# Altium project FanController.PrjPCB
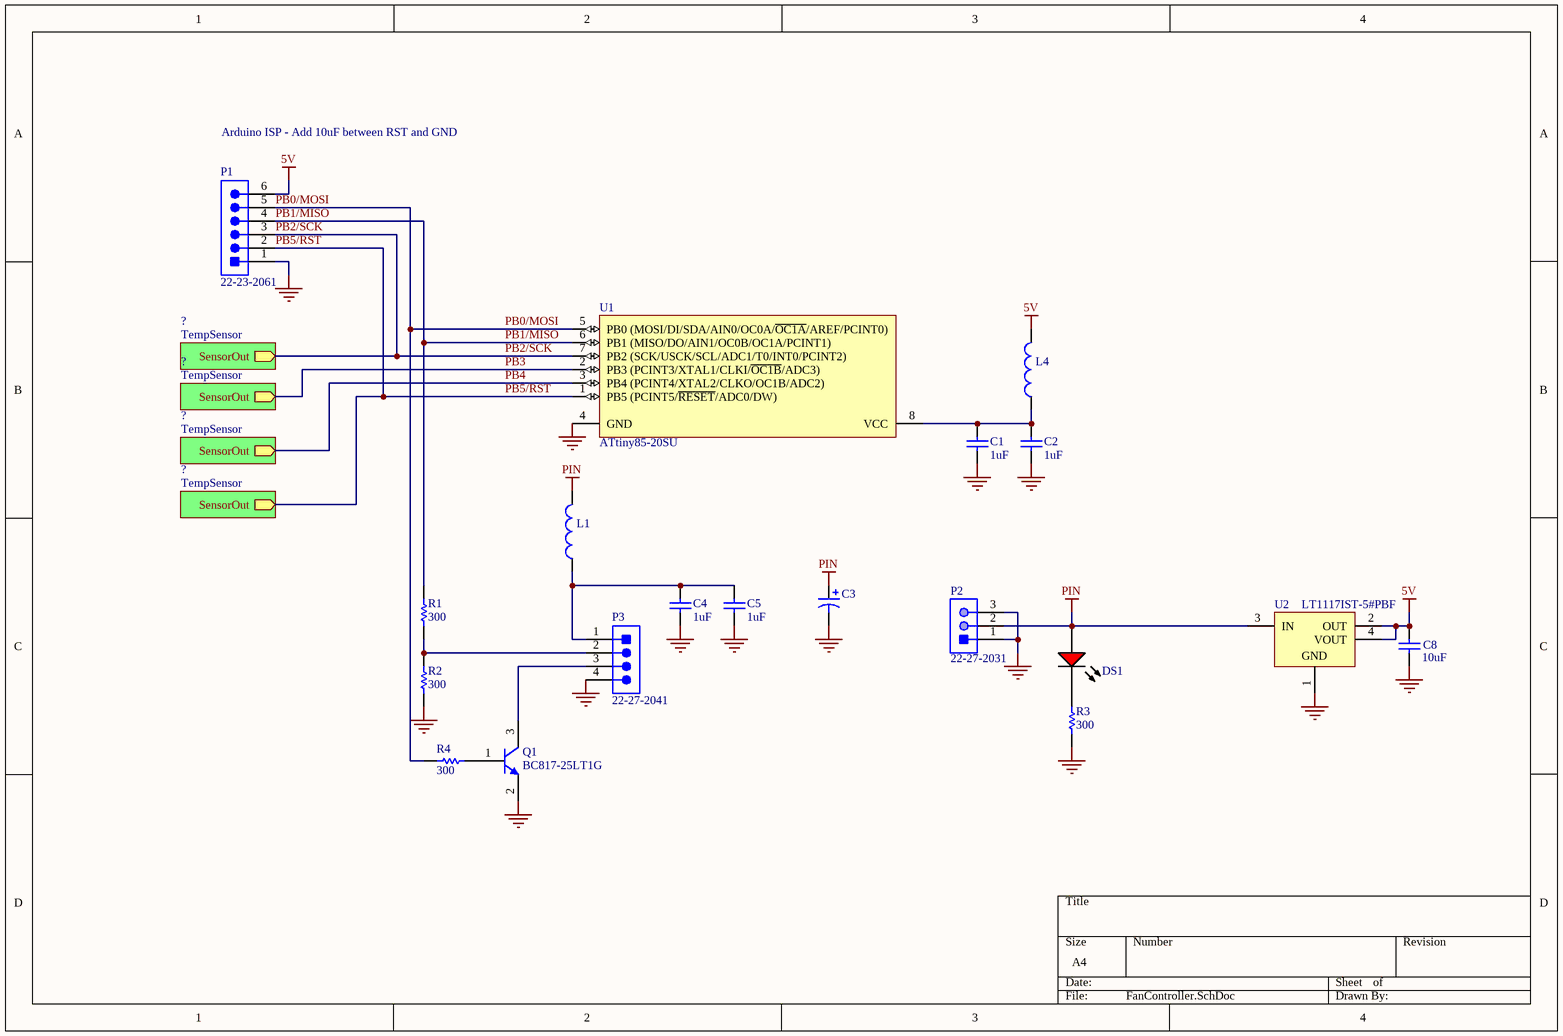
[diagram p0: FanController.SchDoc]
2 sheets, 43 parts. Net scope: hierarchical (ports join the sheet entries above them; power ports are global).
Board file: FanController.PcbDoc
Sheets:
  FanController.SchDoc
    ? = TempSensor.SchDoc
    ? = TempSensor.SchDoc
    ? = TempSensor.SchDoc
    ? = TempSensor.SchDoc

## Sheet FanController.SchDoc
size A4

### Parts
C1  1uF  [CAPC0805(2012)145_N]
C2  1uF  [CAPC0805(2012)145_N]
C3  ECA-1JHG471  [PNSC-ECA-1JHG471]  (value not drawn)
C4  1uF  [CAPC0805(2012)145_N]
C5  1uF  [CAPC0805(2012)145_N]
C8  10uF  [CAPC1206(3216)130_L]
DS1  TLMS1100-GS08  [VISH-TLMX1100_V]  (value not drawn)
L1  FBMJ2125HM210NT  [INDC2013X105X50LL20T30]  (value not drawn)
L4  FBMJ2125HM210NT  [INDC2013X105X50LL20T30]  (value not drawn)
P1  22-23-2061  [MOLX-22-23-2061_V]
P2  22-27-2031  [MOLX-22-27-2031_V]
P3  22-27-2041  [MOLX-22-27-2041_V]
Q1  BC817-25LT1G  [ONSC-SOT-23-3-318-08_V]
R1  300  [RESC0805(2012)_M]
R2  300  [RESC0805(2012)_M]
R3  300  [RESC0805(2012)_M]
R4  300  [RESC0805(2012)_M]
U1  ATtiny85-20SU  [8S2_M]
U2  LT1117IST-5#PBF  [LT-ST-3-SOT-223_L]

### Sub-sheets
? = TempSensor: SensorOut (out)
? = TempSensor: SensorOut (out)
? = TempSensor: SensorOut (out)
? = TempSensor: SensorOut (out)

### Nets
5V: C8.2 L4.2 P1.6 U2.2(OUT) U2.4(VOUT)
GND: C1.1 C2.1 C3.2(-) C4.1 C5.1 C8.1 P1.1 P2.1 P2.3 P3.4 Q1.2(E) R2.1 R3.1 U1.4(GND) U2.1(GND)
PIN: C3.1(+) DS1.1(A) L1.2 P2.2 U2.3(IN)
PB0/MOSI: P1.5 R4.1 U1.5(PB0_(MOSI/DI/SDA/AIN0/OC0A/~{OC1A}/AREF/PCINT0))
PB1/MISO: P1.4 R1.2 U1.6(PB1_(MISO/DO/AIN1/OC0B/OC1A/PCINT1))
PB2/SCK: P1.3 U1.7(PB2_(SCK/USCK/SCL/ADC1/T0/INT0/PCINT2)) ; sheet ?/SensorOut
PB3: U1.2(PB3_(PCINT3/XTAL1/CLKI/~{OC1B}/ADC3)) ; sheet ?/SensorOut
PB4: U1.3(PB4_(PCINT4/XTAL2/CLKO/OC1B/ADC2)) ; sheet ?/SensorOut
PB5/RST: P1.2 U1.1(PB5_(PCINT5/~{RESET}/ADC0/DW)) ; sheet ?/SensorOut
NetC1_2: C1.2 C2.2 L4.1 U1.8(VCC)
NetC4_2: C4.2 C5.2 L1.1 P3.1
NetDS1_2: DS1.2(K) R3.2
NetP3_2: P3.2 R1.1 R2.2
NetP3_3: P3.3 Q1.3(C)
NetQ1_1: Q1.1(B) R4.2

### Notes on the sheet
- Arduino ISP - Add 10uF between RST and GND

### Library data of the parts
C1 C2 C4 C5 = CMP-1036-04431-1: Case-Metric: 2012; Value: 100nF; Rated Voltage: 100 V; Tolerance: Â±20%; Case-EIA: 0805; Technology: SMT; Max Thickness: 1.45 mm
C3 = CMP-1665-00014-2: CAP ALUM 470UF 63V 20% RADIAL; Manufacturer: Panasonic; PartNumber: ECA-1JHG471; ComponentLink1Description: Datasheet; PackageReference: ECA-1JHG471; ComponentLink1URL: http://industrial.panasonic.com/cdbs/www-data/pdf/RDF0000/ABA0000C1038.pdf
C8 = CMP-1037-04970-1: CAP 10uF 10V -20% to +80% 1206 (3216 Metric) Thickness 1.3mm SMD; Case-Metric: 3216; Case-EIA: 1206; Value: 10uF; Rated Voltage: 10 V; Technology: SMT; Max Thickness: 1.3 mm; Tolerance: -20% to +80%
DS1 = CMP-1666-00027-1: LED, RED, 2.1 V, -40 to 100 degC, 2-Pin SMD (0603), RoHS, Tape and Reel; Type (Capacitors): C0G; Resistance: 100000000000 Ohm; Capacitance: 12 pF; Voltage Rating: 50 V; Tolerance: 5%; Min Operating Temperature: -55degC; REACH SVHC: No SVHC; ComponentLink2Description: Datasheet; ComponentLink1URL: http://www.vishay.com/; Width: 0.8 mm; Package Quantity: 4000; PackageReference: TLMX1100; ComponentLink2URL: http://www.vishay.com/docs/83173/tlmb1100.pdf; Case/Package: 0603; Case Code (Metric): 1608; Packaging: Tape and Reel; Pins: 2; ComponentLink1Description: Manufacturer URL; Max Operating Temperature: 125degC; Height: 0.8 mm; Length: 1.6 mm; Mount: Surface Mount; PackageDescription: 2-Pin Surface Mount Device, Body 1.6 x 0.8 mm; DatasheetVersion: Rev. 2.7, 03/2016; Case Code (Imperial): 0603; Voltage Rating (DC): 50 V; RoHSCompliant: True; Radiation Hardening: No
L1 L4 = CMP-1660-00003-1: Chip Inductor, 21 Ohm, +/- 30%, 6 A, -40 to 125 degC, 0805 (2012 Metric), RoHS, Tape and Reel; Core Material: Ferrite; Current Rating: 6 A; Resistance: 4 mohm; Case\Package: 0805; Impedance: 21 Ohm; Min Operating Temperature: -40 degC; Width: 1.25 mm; PackageDescription: 2-Pin Surface Mount Device, Body 2 x 1.25 mm; Mounting Technology: Surface Mount; Package Quantity: 1; DatasheetVersion: 08/2016; Tolerance: 30%; Mount: Surface Mount; Max Operating Temperature: 125 degC; Height: 0.85 mm; ComponentLink1URL: http://www.t-yuden.com/; Case Code (Metric): 2012; ComponentLink1Description: Manufacturer URL; ComponentLink2URL: http://ds.yuden.co.jp/TYCOMPAS/ut/detail.do?productNo=FBMJ2125HM210NT&fileName=FBMJ2125HM210NT_SS&mode=specSheetDownload; Case Code (Imperial): 0805; Packaging: Tape and Reel; ComponentLink2Description: Datasheet; PackageReference: 0805; RoHSCompliant: true; Max Current Rating: 6 A; Length: 2 mm; REACH SVHC: Unknown
P1 = CMP-2000-05536-1: Male Header, Pitch 2.54 mm, 1 x 6 Position, Height 10.67 mm, Tail Length 3.56 mm, 0 to 70 degC, RoHS, Bulk; Manufacturer: Molex; Pitch: 2.54mm; Mounting Angle: Vertical; Current Rating: 4A; Number of Positions / Contacts: 6; Voltage Rating: 250V; Packaging: Bulk; Package Description: Male Header, Pitch 2.54 mm, 1 x 6 Position, Height 10.67 mm, Tail Length 3.56 mm; Number of Rows: 1; Type: PinStrip; Contact Material: Brass; Product Category: .100K.K.Connectors; Factory Pack Quantity: 1000; Mounting Style: ThroughHole; RoHS: Details; Contact Plating: Tin; Housing Material: Nylon; Mounting Technology: ThroughHole; Termination Style: ThroughHole; Tradename: KK; Number of Positions: 6; Brand: Molex; Product Type: Headers; Series: 6373; Datasheet URL: https://datasheet.ciiva.com/19460/232303-19460895.pdf; Package Reference: 22-23-2061; Datasheet Version: Rev. P, 09/2001; Manufacturer URL: http://www.molex.com/
P2 = CMP-2000-05538-1: Male Header, Pitch 2.54 mm, 1 x 3 Position, Height 11.7 mm, Tail Length 3.56 mm, -40 to 80 degC, RoHS, Bulk; Manufacturer: Molex; Voltage rating: 250V; Current rating: 4A; Package Reference: 22-27-2031; Housing material: Nylon(UL94V-0); Operating temperature: 0°Cto+75°C; Package Description: Male Header, Pitch 2.54 mm, 1 x 3 Position, Height 11.7 mm, Tail Length 3.56 mm; Package URL: http://www.molex.com/pdm_docs/sd/022272031_sd.pdf; Datasheet Version: 06/2016; Manufacturer URL: http://www.molex.com/; Mounting Technology: ThroughHole; Datasheet URL: http://www.molex.com/webdocs/datasheets/pdf/en-us/0022272031_PCB_HEADERS.pdf; Contact material: Tinplatedbrass
P3 = CMP-2000-05243-1: Male Header, Pitch 2.54 mm, 1 x 4 Position, Height 11.7 mm, Tail Length 3.56 mm, RoHS, Bulk; Manufacturer: Molex; Voltage rating: 250V; Current rating: 4A; Datasheet Version: Rev. F, 06/2009; Operating temperature: 0degCto+75degC; Contact material: Tinplatedbrass; Manufacturer URL: http://www.molex.com/; Housing material: Nylon(UL94V-0); Datasheet URL: http://www.molex.com/pdm_docs/sd/022272041_sd.pdf
Q1 = CMP-1048-00737-1: General Purpose Transistor, NPN Silicon, 3-Pin SOT-23, Pb-Free, Tape and Reel; Manufacturer: On Semiconductor; IC Continuous (A): 0.5; fT Min (MHz): 100; PackageDescription: 3-Pin Small Outline Transistor, Body 2.92 x 1.3 mm, Pitch 0.95 mm; ComponentLink3Description: Package Specification; ComponentLink2Description: Datasheet; RoHS: TRUE; PackageVersion: Rev. AP, 11/2009; ComponentLink1URL: http://www.onsemi.com/; PackageReference: SOT-23-3-318-08; ComponentLink3URL: http://www.onsemi.cn/pub_link/Collateral/318-08.PDF; ComponentLink2URL: http://www.onsemi.com/pub_link/Collateral/BC817-16LT1-D.PDF; Mounting Technology: Surface Mount; Packing: Tape and Reel; DatasheetVersion: Rev. 12; Polarity: NPN; PartNumber: BC817-25LT1G; ComponentLink1Description: Manufacturer URL
R1-R4 = CMP-1013-00449-1: 300R 0.125W 1% 0805 (2012 Metric)  SMD; Case-Metric: 2012; Value: 300.00 Ohm; Case-EIA: 0805; Technology: SMT; Tolerance: 1 %; Power: 0.125 W
U1 = CMP-0093-00173-2: 8-bit AVR Microcontroller, 20MHz, 2.7-5.5V, 8K Flash, 512 Bytes EEPROM, 512 Bytes SRAM, Industrial Grade (-40°C to 85°C), 8-Lead SOIC, Pb-Free; ComponentLink3Description: ATtiny25/45/85 Summary; DatasheetVersion: revN, Apr-2011; PackageVersion: revF, Apr-2008; ComponentLink3URL: http://www.atmel.com/dyn/resources/prod_documents/2586S.pdf; ComponentLink1URL: http://www.atmel.com/; ComponentLink2Description: ATtiny25/45/85 Datasheet; RevisionNote: DatasheetVersion updated. URLs added.; ComponentLink1Description: Manufacturer URL; PackageReference: 8S2; ComponentLink2URL: http://www.atmel.com/dyn/resources/prod_documents/doc2586.pdf
U2 = CMP-0476-01858-1: 0.8 A Low Dropout Positive Regulator, 2.45 to 15 V Vin, 5 V Vout, 3-pin SOT223 (ST-3), -40 to 125 degC, Pb-Free; Manufacturer: Linear Technology; Iout(mA): 800; Dropout Voltage(V): 1.1; Output Voltage: 5 V; Vin Max(V): 15; PSRR(dB): 75; Number of Outputs: 1; Isupply(mA): 5; Vin Min(V): 2.45; Discrete Pass Element: no; PartNumber: LT1117IST-5#PBF; ComponentLink3Description: Package Specification; DatasheetVersion: Rev. D; RoHS: TRUE; ComponentLink1URL: http://www.linear.com/; PackageVersion: Jun-10; PackageDescription: 3-Pin Plastic SOT-223, 3.505 x 6.505 mm Body, Pitch 2.3 mm; ComponentLink2Description: Datasheet; ComponentLink3URL: http://cds.linear.com/docs/en/packaging/SOT_3_05-08-1630.pdf; ComponentLink2URL: http://cds.linear.com/docs/en/datasheet/1117fd.pdf; Mounting Technology: Surface Mount; ComponentLink1Description: Manufacturer URL; PackageReference: ST-3

## Sheet TempSensor.SchDoc
size A4
Used 4 times, as channels ?, ?, ?, ?. Parts and nets are listed once, with the designators drawn on the sheet.
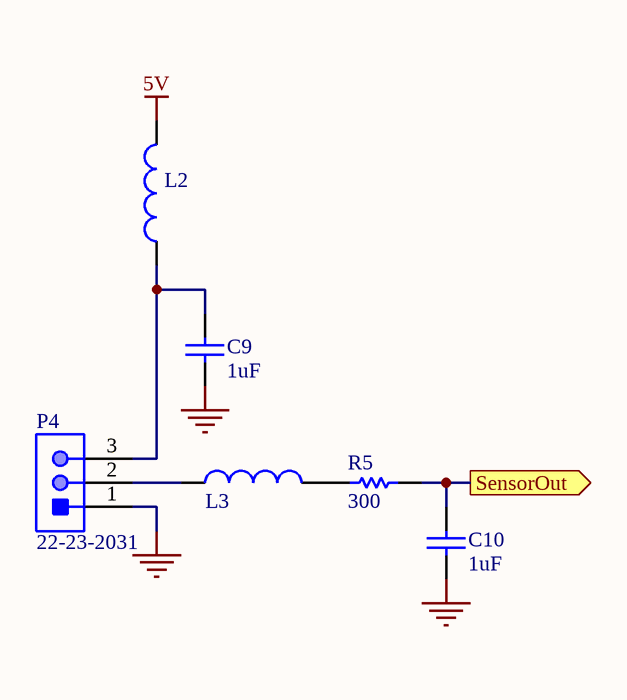
[diagram p1: TempSensor.SchDoc]

### Parts
C9  1uF  [CAPC0805(2012)145_N]
C10  1uF  [CAPC0805(2012)145_N]
L2  FBMJ2125HM210NT  [INDC2013X105X50LL20T30]  (value not drawn)
L3  FBMJ2125HM210NT  [INDC2013X105X50LL20T30]  (value not drawn)
P4  22-23-2031  [MOLX-22-23-2031_V]
R5  300  [RESC0805(2012)_M]

### Ports
SensorOut (out)

### Nets
5V: L2.2
GND: C9.2 C10.1 P4.1
SensorOut: C10.2 R5.2 ; port SensorOut
NetC9_1: C9.1 L2.1 P4.3
NetL3_1: L3.1 P4.2
NetL3_2: L3.2 R5.1

### Channels
?: designators end in _?4; ports SensorOut=PB2/SCK
?: designators end in _?3; ports SensorOut=PB3
?: designators end in _?2; ports SensorOut=PB4
?: designators end in _?1; ports SensorOut=PB5/RST

### Library data of the parts
C9 C10 = CMP-1036-04431-1: as C1 on sheet FanController; Technology: SMT; Max Thickness: 1.45 mm
L2 L3 = CMP-1660-00003-1: as L1 on sheet FanController; Min Operating Temperature: -40 degC; Width: 1.25 mm; PackageDescription: 2-Pin Surface Mount Device, Body 2 x 1.25 mm; Mounting Technology: Surface Mount; Package Quantity: 1; DatasheetVersion: 08/2016; Tolerance: 30%; Mount: Surface Mount; Max Operating Temperature: 125 degC; Height: 0.85 mm; ComponentLink1URL: http://www.t-yuden.com/; Case Code (Metric): 2012; ComponentLink1Description: Manufacturer URL; ComponentLink2URL: http://ds.yuden.co.jp/TYCOMPAS/ut/detail.do?productNo=FBMJ2125HM210NT&fileName=FBMJ2125HM210NT_SS&mode=specSheetDownload; Case Code (Imperial): 0805; Packaging: Tape and Reel; ComponentLink2Description: Datasheet; PackageReference: 0805; RoHSCompliant: true; Max Current Rating: 6 A; Length: 2 mm; REACH SVHC: Unknown
P4 = CMP-2000-05242-1: Male Header, Pitch 2.54 mm, 1 x 3 Position, Height 8.18 mm, Tail Length 3.56 mm, RoHS, Bulk; Current Rating: 4A; Brand: Molex; Pitch: 2.54mm; Voltage Rating: 250V; Mounting Angle: Vertical; Type: Locking; Factory Pack Quantity: 16000; Tradename: KK; Housing Material: Nylon; Contact Material: Brass; Manufacturer URL: http://www.molex.com/; Termination Style: ThroughHole; Mounting Style: ThroughHole; Number of Positions: 3Position; Contact Gender: Pin(Male); Packaging: Bulk; Series: 6373; Datasheet Version: Sep-01; Contact Plating: Tin; Product: Headers; Datasheet URL: https://datasheet.ciiva.com/19472/232274-19472863.pdf; RoHS: Details; Product Category: Headers&WireHousings; Manufacturer: Molex; Number of Rows: 1Row
R5 = CMP-1013-00449-1: as R1 on sheet FanController; Technology: SMT; Tolerance: 1 %; Power: 0.125 W

## Nets that join several sheets
5V: FanController (5 pins), ? (L2_?4.2), ? (L2_?3.2), ? (L2_?2.2), ? (L2_?1.2)
GND: FanController (15 pins), ? (C9_?4.2 C10_?4.1 P4_?4.1), ? (C9_?3.2 C10_?3.1 P4_?3.1), ? (C9_?2.2 C10_?2.1 P4_?2.1), ? (C9_?1.2 C10_?1.1 P4_?1.1)
PB2/SCK: FanController (P1.3 U1.7), ? (C10_?4.2 R5_?4.2)
PB3: FanController (U1.2), ? (C10_?3.2 R5_?3.2)
PB4: FanController (U1.3), ? (C10_?2.2 R5_?2.2)
PB5/RST: FanController (P1.2 U1.1), ? (C10_?1.2 R5_?1.2)